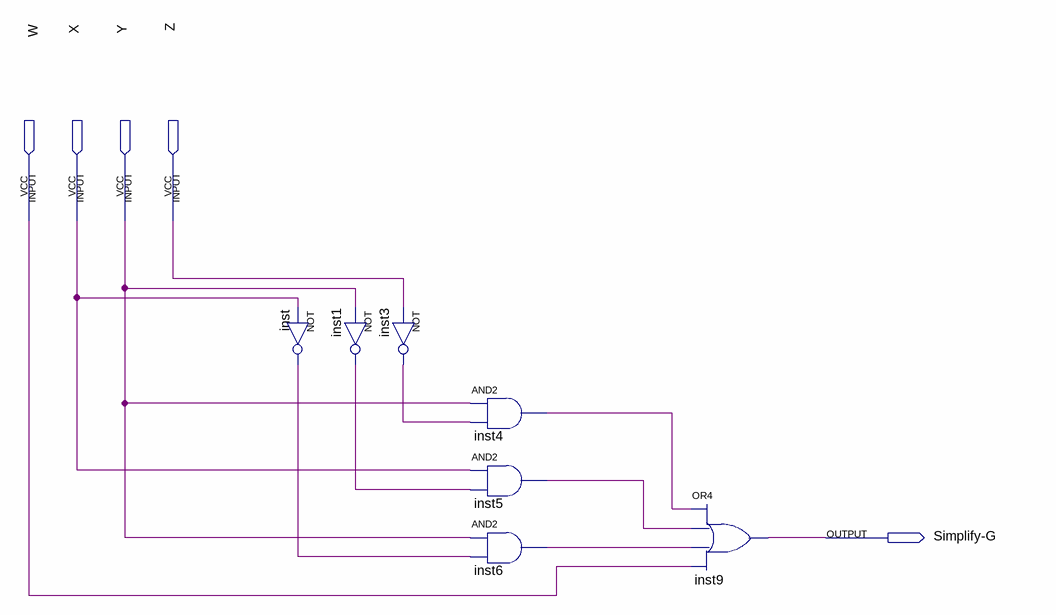
[diagram p0: schematic sheet]
// Quartus schematic Simplify-G.bdf as structural Verilog: 7 symbols, 5 pins
module \Simplify-G  (
  input  W,
  input  X,
  input  Y,
  input  Z,
  output \Simplify-G 
);

  wire inst1_out, inst3_out, inst4_out, inst5_out, inst6_out, inst_out;

  not inst (inst_out, X);
  not inst1 (inst1_out, Y);
  not inst3 (inst3_out, Z);
  and inst4 (inst4_out, Y, inst3_out);
  and inst5 (inst5_out, X, inst1_out);
  and inst6 (inst6_out, Y, inst_out);
  or inst9 (\Simplify-G , inst4_out, inst5_out, inst6_out, W);
endmodule
